# Altium schematic sheet Mcu_at89s52.SchDoc
size A4; DocumentNumber: 2; SheetNumber: 2; SheetTotal: 2
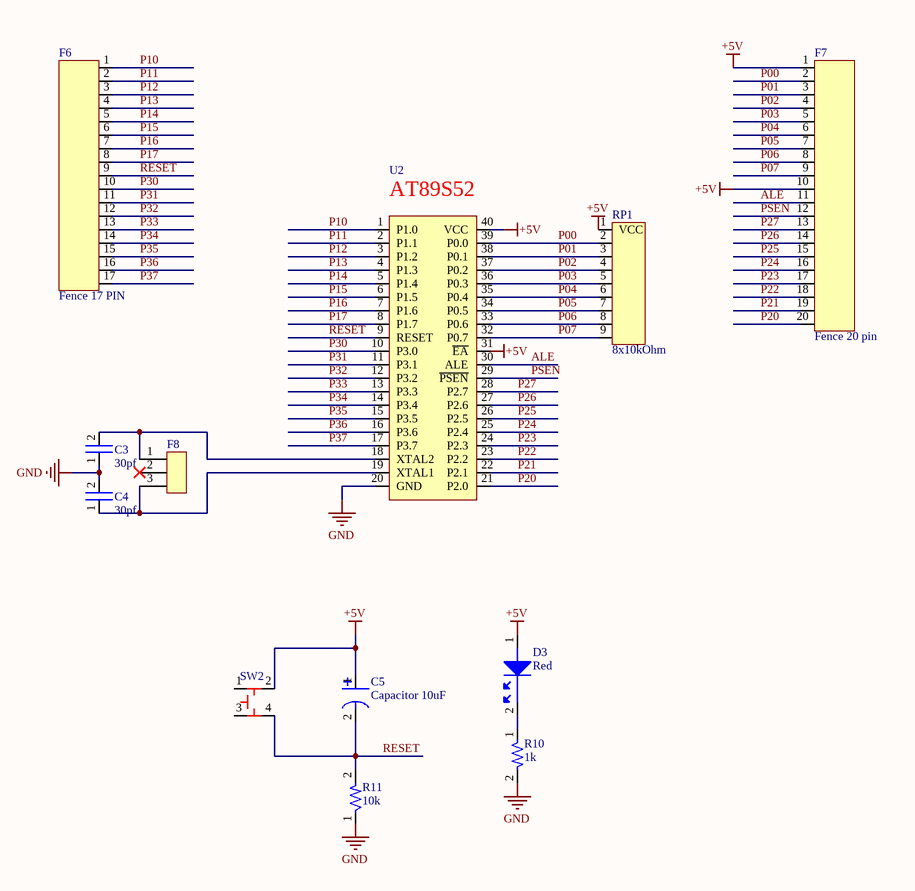
[diagram p0: Mcu_at89s52.SchDoc]

## Parts
C3  30pf  [CAP_30pF]
C4  30pf  [CAP_30pF]
C5  Capacitor 10uF  [Capacitor 10uF 50V]
D3  Red  [LED - 3mm]
F6  Fence 17 PIN  [Fence 17PIN]
F7  Fence 20 pin  [Fence 20PIN]
F8  Fence 3 pin  [Fence 3pin_female]  (value not drawn)
R10  1k  [RESISTOR 1W]
R11  10k  [RESISTOR 10k_0.5W]
RP1  8x10kOhm  [RES_10K_PACK_9PIN]
SW2  Sw_4pin  [SW_4PIN]  (value not drawn)
U2  Ic_socket_40pin_2.54mm  [IC_SOKET_40PIN]  (value not drawn)

## Nets
+5V: C5.1 D3.1 F7.1(VCC) F7.10(VCC) RP1.1(VCC) SW2.2 U2.31(~{EA}) U2.40(VCC)
GND: C3.1 C4.2 R10.2 R11.1 U2.20(GND)
ALE: F7.11(VCC) U2.30(ALE)
P00: F7.2(VCC) RP1.2 U2.39(P0.0)
P01: F7.3(VCC) RP1.3 U2.38(P0.1)
P02: F7.4(VCC) RP1.4 U2.37(P0.2)
P03: F7.5(VCC) RP1.5 U2.36(P0.3)
P04: F7.6(VCC) RP1.6 U2.35(P0.4)
P05: F7.7(VCC) RP1.7 U2.34(P0.5)
P06: F7.8(VCC) RP1.8 U2.33(P0.6)
P07: F7.9(VCC) RP1.9 U2.32(P0.7)
P10: F6.1(VCC) U2.1(P1.0)
P11: F6.2(VCC) U2.2(P1.1)
P12: F6.3(VCC) U2.3(P1.2)
P13: F6.4(VCC) U2.4(P1.3)
P14: F6.5(VCC) U2.5(P1.4)
P15: F6.6(VCC) U2.6(P1.5)
P16: F6.7(VCC) U2.7(P1.6)
P17: F6.8(VCC) U2.8(P1.7)
P20: F7.20(VCC) U2.21(P2.0)
P21: F7.19(VCC) U2.22(P2.1)
P22: F7.18(VCC) U2.23(P2.2)
P23: F7.17(VCC) U2.24(P2.3)
P24: F7.16(VCC) U2.25(P2.4)
P25: F7.15(VCC) U2.26(P2.5)
P26: F7.14(VCC) U2.27(P2.6)
P27: F7.13(VCC) U2.28(P2.7)
P30: F6.10(VCC) U2.10(P3.0)
P31: F6.11(VCC) U2.11(P3.1)
P32: F6.12(VCC) U2.12(P3.2)
P33: F6.13(VCC) U2.13(P3.3)
P34: F6.14(VCC) U2.14(P3.4)
P35: F6.15(VCC) U2.15(P3.5)
P36: F6.16(VCC) U2.16(P3.6)
P37: F6.17(VCC) U2.17(P3.7)
PSEN: F7.12(VCC) U2.29(~{PSEN})
RESET: C5.2 F6.9(VCC) R11.2 SW2.4 U2.9(RESET)
NetC3_2: C3.2 F8.1 U2.18(XTAL2)
NetC4_1: C4.1 F8.3 U2.19(XTAL1)
NetD3_2: D3.2 R10.1

Not connected (* = marked no-connect by the designer): F8 2*; SW2 1 3

## Notes on the sheet
- (in symbol Ic_socket_40pin_2.54mm) AT89S52

## Library data of the parts
C3 C4 = Capacitor 33pf: Tụ hóa 33pf 50V
C5 = Capacitor 10uF: Tụ hóa 10uF 55V
D3 = LED: LED 5mm
F8 = Fence 3 pin: hàng rào male 6 chân
R10 R11 = Resistor: dien tro
RP1 = Resistor_pack_9pin